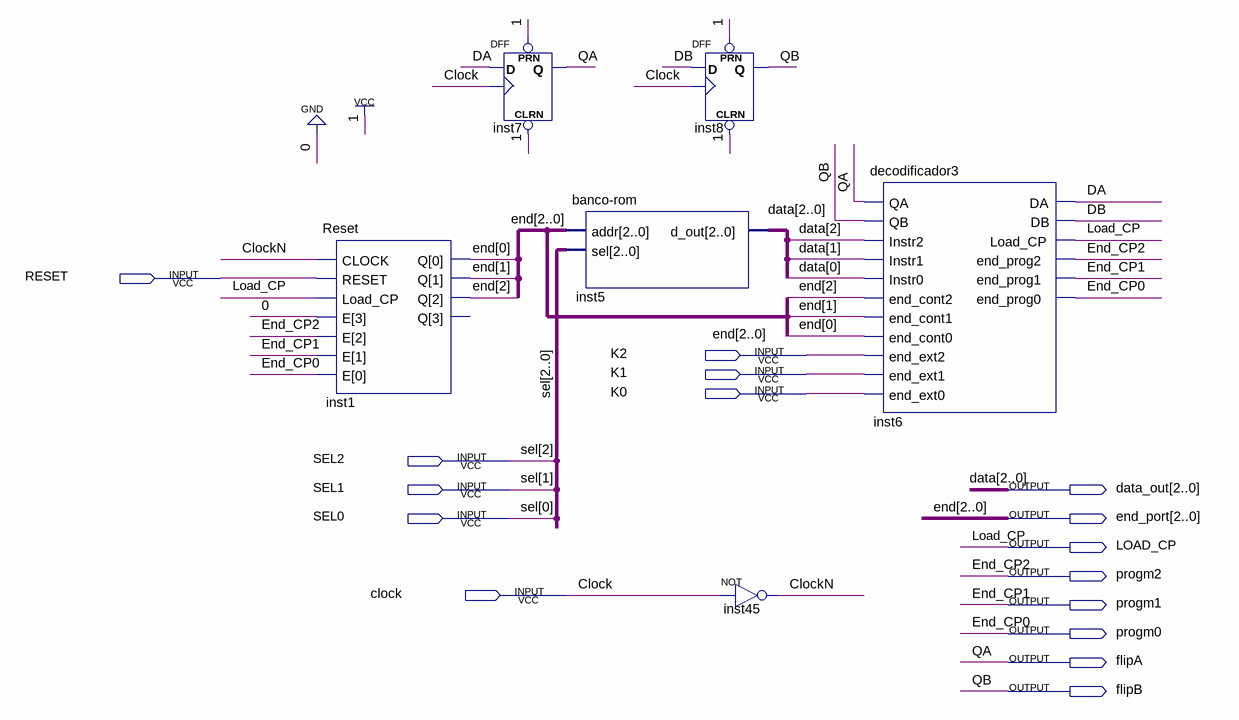
[diagram p0: schematic sheet]
// Quartus schematic circuito.bdf as structural Verilog: 6 symbols, 16 pins
module circuito (
  input  RESET,
  input  K2,
  input  K1,
  input  K0,
  input  SEL2,
  input  SEL1,
  input  SEL0,
  input  clock,
  output [2:0] data_out,
  output [2:0] end_port,
  output LOAD_CP,
  output progm2,
  output progm1,
  output progm0,
  output flipA,
  output flipB
);

  wire ClockN, DA, DB;
  wire [3:0] inst1_q_open;  // unused outputs

  Reset inst1 (
    .CLOCK(ClockN), .RESET(RESET), .Load_CP(LOAD_CP), .E({1'b0, progm2, progm1, progm0}),
    .Q({inst1_q_open[3], end_port}));
  DFF inst7 (.CLRN(1'b1), .CLK(clock), .D(DA), .PRN(1'b1), .Q(flipA));
  \banco-rom  inst5 (.addr(end_port), .sel({SEL2, SEL1, SEL0}), .d_out(data_out));
  DFF inst8 (.CLRN(1'b1), .CLK(clock), .D(DB), .PRN(1'b1), .Q(flipB));
  not inst45 (ClockN, clock);
  decodificador3 inst6 (
    .QA(flipA), .QB(flipB), .Instr2(data_out[2]), .Instr1(data_out[1]), .Instr0(data_out[0]),
    .end_cont2(end_port[2]), .end_cont1(end_port[1]), .end_cont0(end_port[0]), .end_ext2(K2), .end_ext1(K1),
    .end_ext0(K0), .DA(DA), .DB(DB), .Load_CP(LOAD_CP), .end_prog2(progm2), .end_prog1(progm1),
    .end_prog0(progm0));

  // Other names for the same wires on the sheet: data[2:0] = data_out; end[2:0] = end_port; End_CP0 = progm0;
  //   End_CP1 = progm1; End_CP2 = progm2; QA = flipA; QB = flipB
endmodule
